# Altium schematic sheet Low Side Drivers.SchDoc: RB25DET - Low Side Drivers
size A4; Address1: Drawn By:; Address2: Dan Visser; DocumentNumber: A; Revision: 0.1; SheetNumber: 10; SheetTotal: 12
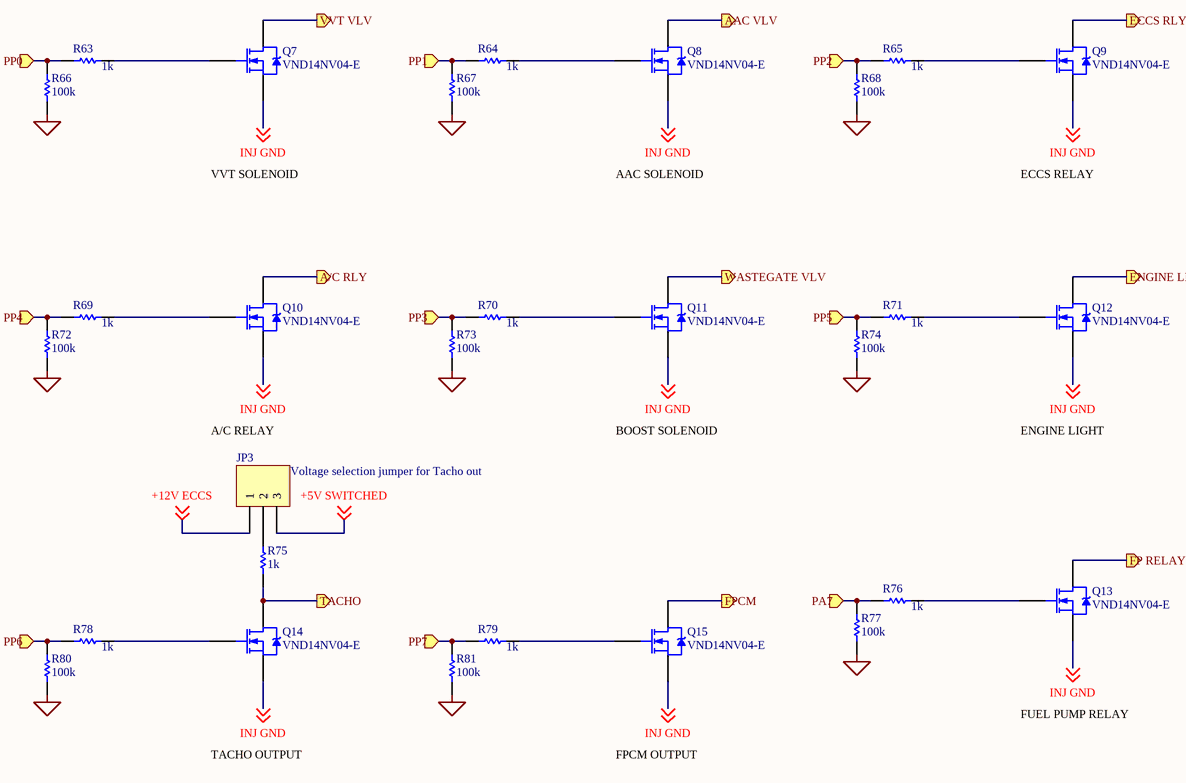
[diagram p0: Low Side Drivers.SchDoc]

## Parts
JP3  Voltage selection jumper for Tacho out  [HDR1X3]
Q7  VND14NV04-E  [TO-220AB]
Q8  VND14NV04-E  [TO-220AB]
Q9  VND14NV04-E  [TO-220AB]
Q10  VND14NV04-E  [TO-220AB]
Q11  VND14NV04-E  [TO-220AB]
Q12  VND14NV04-E  [TO-220AB]
Q13  VND14NV04-E  [TO-220AB]
Q14  VND14NV04-E  [TO-220AB]
Q15  VND14NV04-E  [TO-220AB]
R63  value 1k  [AXIAL-0.3]
R64  value 1k  [AXIAL-0.3]
R65  value 1k  [AXIAL-0.3]
R66  value 100k  [AXIAL-0.3]
R67  value 100k  [AXIAL-0.3]
R68  value 100k  [AXIAL-0.3]
R69  value 1k  [AXIAL-0.3]
R70  value 1k  [AXIAL-0.3]
R71  value 1k  [AXIAL-0.3]
R72  value 100k  [AXIAL-0.3]
R73  value 100k  [AXIAL-0.3]
R74  value 100k  [AXIAL-0.3]
R75  value 1k  [AXIAL-0.3]
R76  value 1k  [AXIAL-0.3]
R77  value 100k  [AXIAL-0.3]
R78  value 1k  [AXIAL-0.3]
R79  value 1k  [AXIAL-0.3]
R80  value 100k  [AXIAL-0.3]
R81  value 100k  [AXIAL-0.3]

## Ports
A/C RLY (out), AAC VLV (out), ECCS RLY (out), ENGINE LIGHT (out), FP RELAY (out), FPCM (out), PA7 (in), PP0 (in), PP1 (in), PP2 (in), PP3 (in), PP4 (in), PP5 (in), PP6 (in), PP7 (in), TACHO (out), VVT VLV (out), WASTEGATE VLV (out)

## Nets
NetR66_1: R66.1 R67.1 R68.1 R72.1 R73.1 R74.1 R77.1 R80.1 R81.1
+5V SWITCHED: JP3.3 ; off-sheet +5V SWITCHED
+12V ECCS: JP3.1 ; off-sheet +12V ECCS
A/C RLY: Q10.2(D) ; port A/C RLY
AAC VLV: Q8.2(D) ; port AAC VLV
ECCS RLY: Q9.2(D) ; port ECCS RLY
ENGINE LIGHT: Q12.2(D) ; port ENGINE LIGHT
FP RELAY: Q13.2(D) ; port FP RELAY
FPCM: Q15.2(D) ; port FPCM
INJ GND: Q7.3(S) Q8.3(S) Q9.3(S) Q10.3(S) Q11.3(S) Q12.3(S) Q13.3(S) Q14.3(S) Q15.3(S) ; off-sheet INJ GND
PA7: R76.1 R77.2 ; port PA7
PP0: R63.1 R66.2 ; port PP0
PP1: R64.1 R67.2 ; port PP1
PP2: R65.1 R68.2 ; port PP2
PP3: R70.1 R73.2 ; port PP3
PP4: R69.1 R72.2 ; port PP4
PP5: R71.1 R74.2 ; port PP5
PP6: R78.1 R80.2 ; port PP6
PP7: R79.1 R81.2 ; port PP7
TACHO: Q14.2(D) R75.1 ; port TACHO
VVT VLV: Q7.2(D) ; port VVT VLV
WASTEGATE VLV: Q11.2(D) ; port WASTEGATE VLV
NetJP3_2: JP3.2 R75.2
NetQ7_1: Q7.1(G) R63.2
NetQ8_1: Q8.1(G) R64.2
NetQ9_1: Q9.1(G) R65.2
NetQ10_1: Q10.1(G) R69.2
NetQ11_1: Q11.1(G) R70.2
NetQ12_1: Q12.1(G) R71.2
NetQ13_1: Q13.1(G) R76.2
NetQ14_1: Q14.1(G) R78.2
NetQ15_1: Q15.1(G) R79.2

## Notes on the sheet
- VVT SOLENOID
- AAC SOLENOID
- ECCS RELAY
- A/C RELAY
- BOOST SOLENOID
- ENGINE LIGHT
- FUEL PUMP RELAY
- TACHO OUTPUT
- FPCM OUTPUT
- Title
- Size:
- Date:
- A4
- Number:
- Time:
- Revision:
- Sheet
- of

## Library data of the parts
JP3 = Header 3: Header, 3-Pin; LatestRevisionDate: 17-Jul-2002; LatestRevisionNote: Re-released for DXP Platform.; Publisher: Altium Limited
Q7-Q15 = IRL520N: HEXFET Power MOSFET; Note: Pin 2 is electrically connected to pin 4 (Drain).; Published: 8-Jun-2000; LatestRevisionDate: 17-Jul-2002; LatestRevisionNote: Re-released for DXP Platform.; DatasheetVersion: May-1998; PackageVersion: Feb-1997; PackageReference: TO-220AB; Publisher: Altium Limited; PackageDescription: TO, Thru-Hole, Vertical, Heatsink Mounted; 3 In-Line Leads; Pitch 2.54 mm; ComponentLink1Description: Manufacturer Link; ComponentLink1URL: http://www.irf.com/; ComponentLink2Description: Datasheet; ComponentLink2URL: http://www.irf.com/product-info/datasheets/data/irl520n.pdf
R63-R81 = Res1: Resistor; Published: 8-Jun-2000; LatestRevisionDate: 17-Jul-2002; LatestRevisionNote: Re-released for DXP Platform.; PackageReference: AXIAL-0.3; Publisher: Altium Limited; PackageDescription: Axial Device, Thru-Hole; 2 Leads; 0.3 in Pin Spacing